# EAGLE design socket-a-1 (EAGLE 9.6.2)
AUTHOR: Balazs Racz; DRAWING_TITLE: MEB Schalterwerk Projekt; LICENSE: Licensed by the Solderpad Hardware License V2.0; REVIEWER: n/a; REVISION: A1; YEAR: 2023
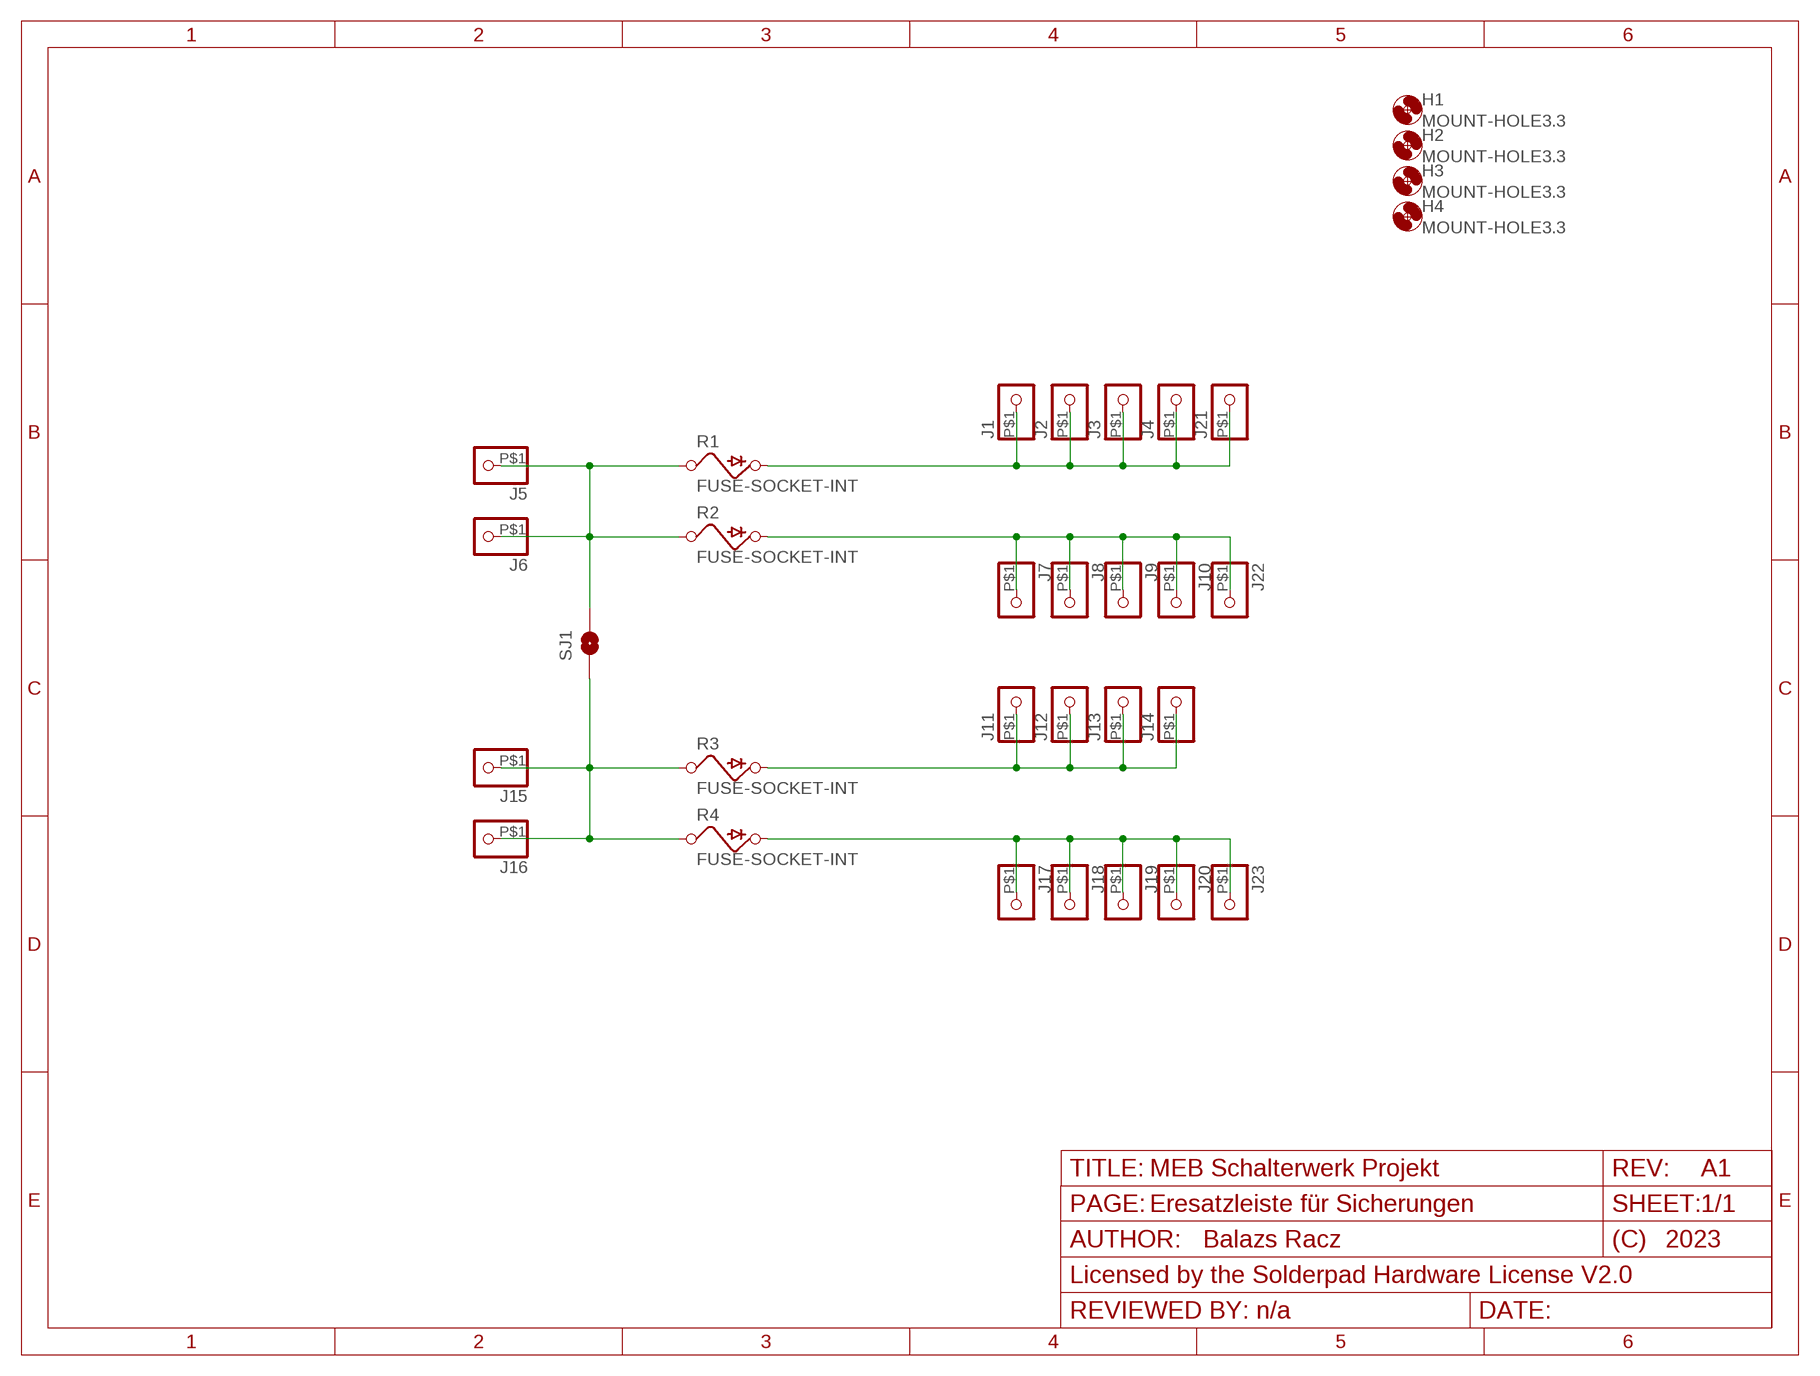
[diagram p0: schematic, sheet 1]
FRAME1 (FRAME_A_L): PAGE: Eresatzleiste für Sicherungen
FRAME2 (FRAME_A_L): PAGE: Input ports

## Parts
H1  MOUNT-HOLE3.3  [3,3]
H2  MOUNT-HOLE3.3  [3,3]
H3  MOUNT-HOLE3.3  [3,3]
H4  MOUNT-HOLE3.3  [3,3]
J1  LARGE-SOLDERPAD  [LARGE-SOLDERPAD]
J2  LARGE-SOLDERPAD  [LARGE-SOLDERPAD]
J3  LARGE-SOLDERPAD  [LARGE-SOLDERPAD]
J4  LARGE-SOLDERPAD  [LARGE-SOLDERPAD]
J5  LARGE-SOLDERPAD  [LARGE-SOLDERPAD]
J6  LARGE-SOLDERPAD  [LARGE-SOLDERPAD]
J7  LARGE-SOLDERPAD  [LARGE-SOLDERPAD]
J8  LARGE-SOLDERPAD  [LARGE-SOLDERPAD]
J9  LARGE-SOLDERPAD  [LARGE-SOLDERPAD]
J10  LARGE-SOLDERPAD  [LARGE-SOLDERPAD]
J11  LARGE-SOLDERPAD  [LARGE-SOLDERPAD]
J12  LARGE-SOLDERPAD  [LARGE-SOLDERPAD]
J13  LARGE-SOLDERPAD  [LARGE-SOLDERPAD]
J14  LARGE-SOLDERPAD  [LARGE-SOLDERPAD]
J15  LARGE-SOLDERPAD  [LARGE-SOLDERPAD]
J16  LARGE-SOLDERPAD  [LARGE-SOLDERPAD]
J17  LARGE-SOLDERPAD  [LARGE-SOLDERPAD]
J18  LARGE-SOLDERPAD  [LARGE-SOLDERPAD]
J19  LARGE-SOLDERPAD  [LARGE-SOLDERPAD]
J20  LARGE-SOLDERPAD  [LARGE-SOLDERPAD]
J21  LARGE-SOLDERPAD  [LARGE-SOLDERPAD]
J22  LARGE-SOLDERPAD  [LARGE-SOLDERPAD]
J23  LARGE-SOLDERPAD  [LARGE-SOLDERPAD]
R1  FUSE-SOCKET-INT  [FUSE-SOCKET-INT]
R2  FUSE-SOCKET-INT  [FUSE-SOCKET-INT]
R3  FUSE-SOCKET-INT  [FUSE-SOCKET-INT]
R4  FUSE-SOCKET-INT  [FUSE-SOCKET-INT]
SJ1  SJRND2  [SJ_RND2]

## Nets
N$1: J15.P$1 J16.P$1 R3.PIN1(PIN) R3.PIN2(PIN) R4.PIN1(PIN) R4.PIN2(PIN) SJ1.P$1
N$2: J11.P$1 J12.P$1 J13.P$1 J14.P$1 R3.POUT
N$3: J17.P$1 J18.P$1 J19.P$1 J20.P$1 J23.P$1 R4.POUT
N$4: J5.P$1 J6.P$1 R1.PIN1(PIN) R1.PIN2(PIN) R2.PIN1(PIN) R2.PIN2(PIN) SJ1.P$2
N$5: J1.P$1 J2.P$1 J3.P$1 J4.P$1 J21.P$1 R1.POUT
N$6: J7.P$1 J8.P$1 J9.P$1 J10.P$1 J22.P$1 R2.POUT

## Library data of the parts
H1-H4 = holes:MOUNT-HOLE: MOUNTING HOLE with drill center marker
J1-J23 = eagleparts:LARGE-SOLDERPAD
R1-R4 = eagleparts:FUSE-SOCKET-INT
SJ1 = eagleparts:SJ: SMD solder JUMPER

## Board
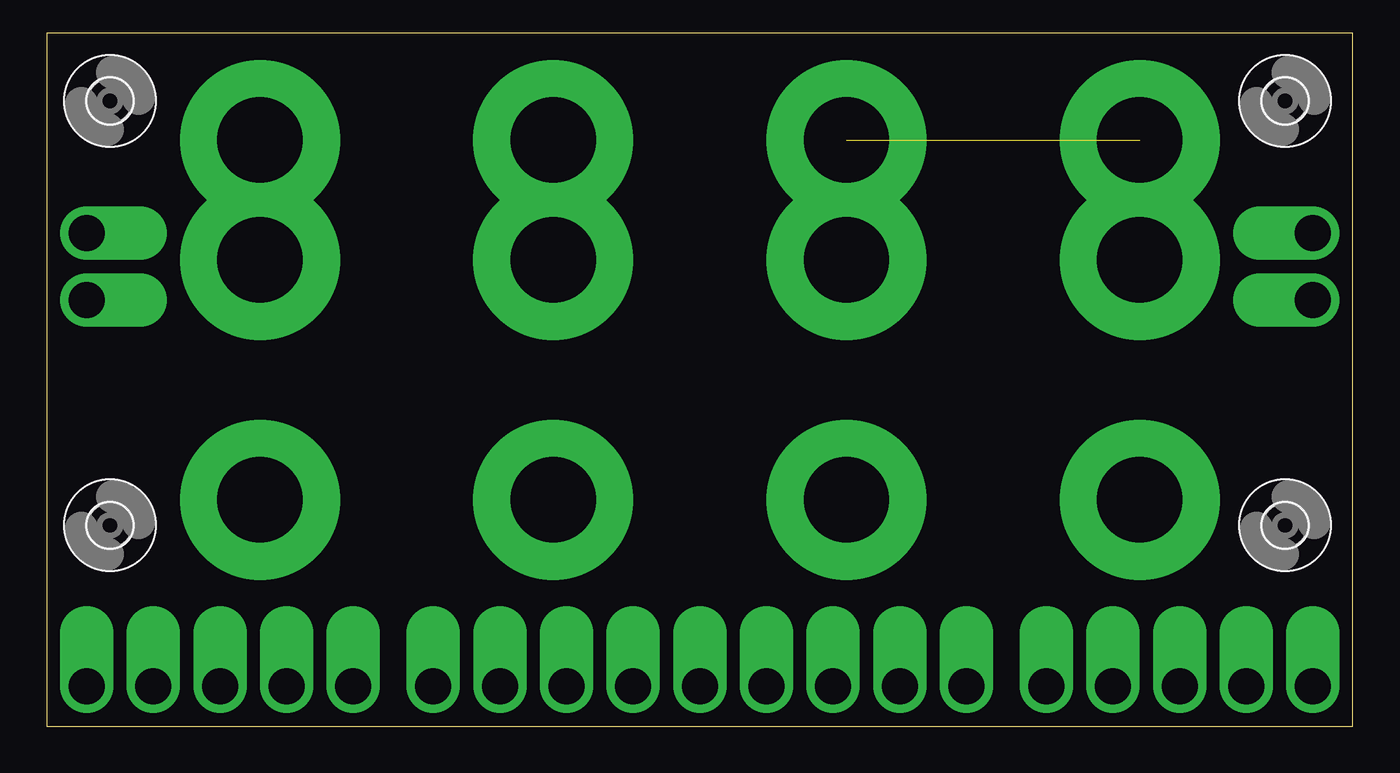
[diagram p1: board, top side]
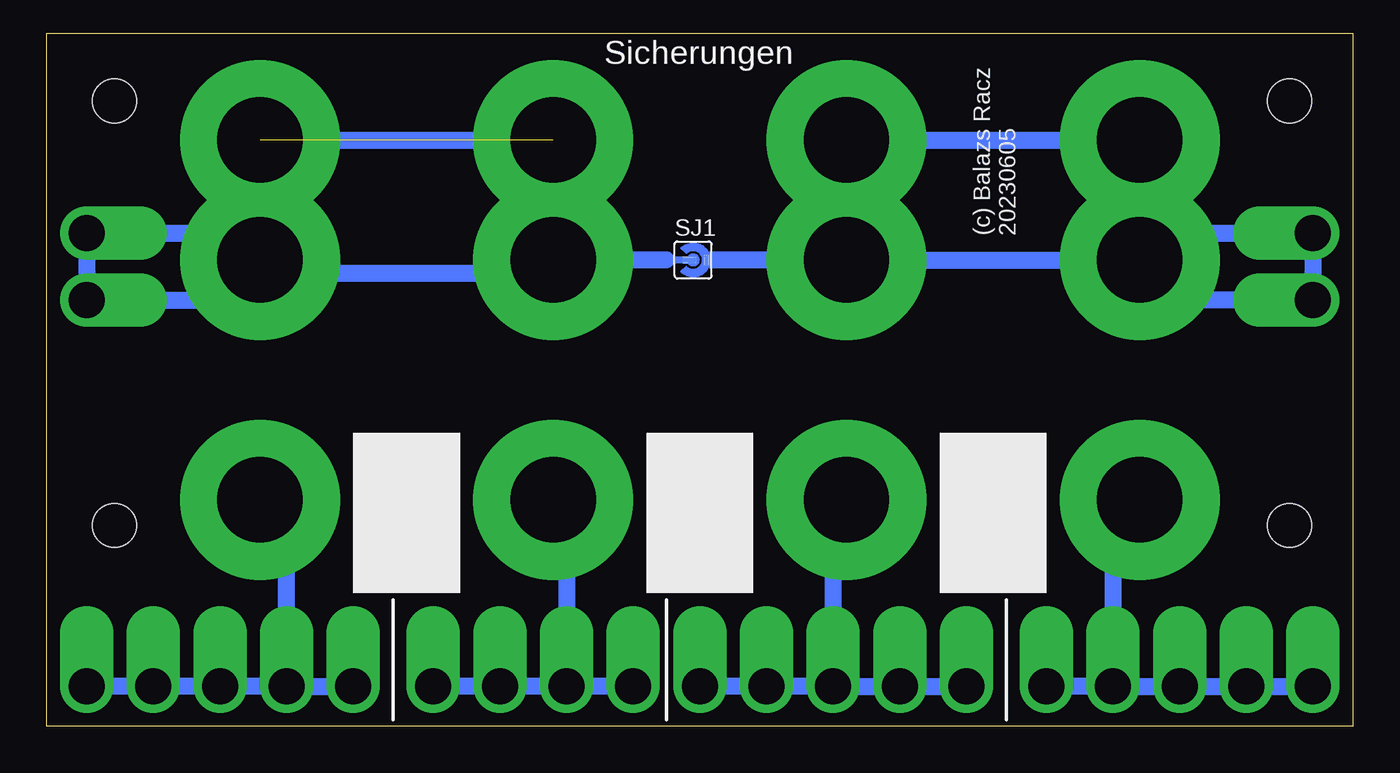
[diagram p2: board, bottom side, seen from below]

Size 98 x 52.01 mm. Coordinates in mm from the lower left corner, seen from the top.
Outline: 0,0 98,0 98,52.01 0,52 0,0
Copper layers (1*16): Top 0.035mm / dielectric 1.5mm / Bottom 0.035mm
Design rules "SeeedStudio_2layer_DRU_no_angle_20140221": minimum track width 6mil, minimum drill 12mil, track to track 6mil, track to pad 6mil, pad to pad 6mil, via to via 6mil, smd to smd 0mil, copper to edge 10mil, drill to drill 10mil, minimum pad ring 10mil, minimum via ring 6mil, stop-mask expansion 2mil, vias tented up to drill 100mil, thermal gap 10mil

### Footprints (pad centres in the part's own frame; a part is rotated, then mirrored left to right if it is on the bottom)
3,3 = hole 3.3: 0,0
LARGE-SOLDERPAD = drill 2.7 pad 4 offset: P$1 0,0
FUSE-SOCKET-INT = drill 6.4 pad 12: PIN1 0,27; PIN2 0,18; POUT 0,0
SJ_RND2 = smd 1.016 x 0.508: P$1 -0.254,0 | smd 0.406 x 0.813: P$2 1.016,0

### Placement (x,y rotation side)
H1  92.92,46.93 0 top
H2  92.92,15.08 0 top
H3  4.75,15.08 0 top
H4  4.75,46.93 0 top
J1  44,3 0 bottom
J2  39,3 0 bottom
J3  34,3 0 bottom
J4  29,3 0 bottom
J5  3,37 90 bottom
J6  3,32 90 bottom
J7  3,3 0 bottom
J8  8,3 0 bottom
J9  13,3 0 bottom
J10  18,3 0 bottom
J11  54,3 0 bottom
J12  69,3 0 bottom
J13  59,3 0 bottom
J14  64,3 0 bottom
J15  95,37 270 bottom
J16  95,32 270 bottom
J17  95,3 0 bottom
J18  85,3 0 bottom
J19  80,3 0 bottom
J20  90,3 0 bottom
J21  49,3 0 bottom
J22  23,3 0 bottom
J23  75,3 0 bottom
R1  38,17 0 bottom
R2  16,17 0 bottom
R3  60,17 0 bottom
R4  82,17 0 bottom
SJ1  49.5,35 0 bottom

### Tracks (layer width: path | path; a pad name or v marks a point on that pad's centre or on a via)
N$1  (2 unrouted)
  Bottom 0.508: SJ1.P$1 51.5,35
  Bottom 1.27: R4.PIN2 84,37 J15.P$1 J16.P$1 84,32 82,34 R4.PIN2 | R4.PIN2 R4.PIN1 R3.PIN1 R3.PIN2 | R3.PIN2 60,34 81,34 R4.PIN2 | 51.5,35 R3.PIN2
N$2
  Bottom 1.27: R3.POUT 59,16 J13.P$1 | J11.P$1 J13.P$1 | J13.P$1 J14.P$1 J12.P$1
N$3
  Bottom 1.27: R4.POUT 80,15 J19.P$1 | J19.P$1 J18.P$1 J20.P$1 J17.P$1 | J19.P$1 J23.P$1
N$4
  Bottom 0.2: 48.19,35 SJ1.P$2
  Bottom 1.27: R1.PIN2 R1.PIN1 R2.PIN1 15,43 15,35 | R1.PIN2 15,35 | R2.PIN2 14,37 J5.P$1 J6.P$1 12,32 15,35 | R1.PIN2 48.19,35
N$5
  Bottom 1.27: R1.POUT 39,16 J2.P$1 | J2.P$1 J1.P$1 J21.P$1 | J2.P$1 J3.P$1 J4.P$1
N$6
  Bottom 1.27: R2.POUT 18,15 J10.P$1 | J10.P$1 J9.P$1 J8.P$1 J7.P$1 | J10.P$1 J22.P$1

### Text on the board
bNames: Sicherungen | (c) Balazs Racz / 20230605